# EAGLE schematic usbaspclone-1-1 (EAGLE 5.10)
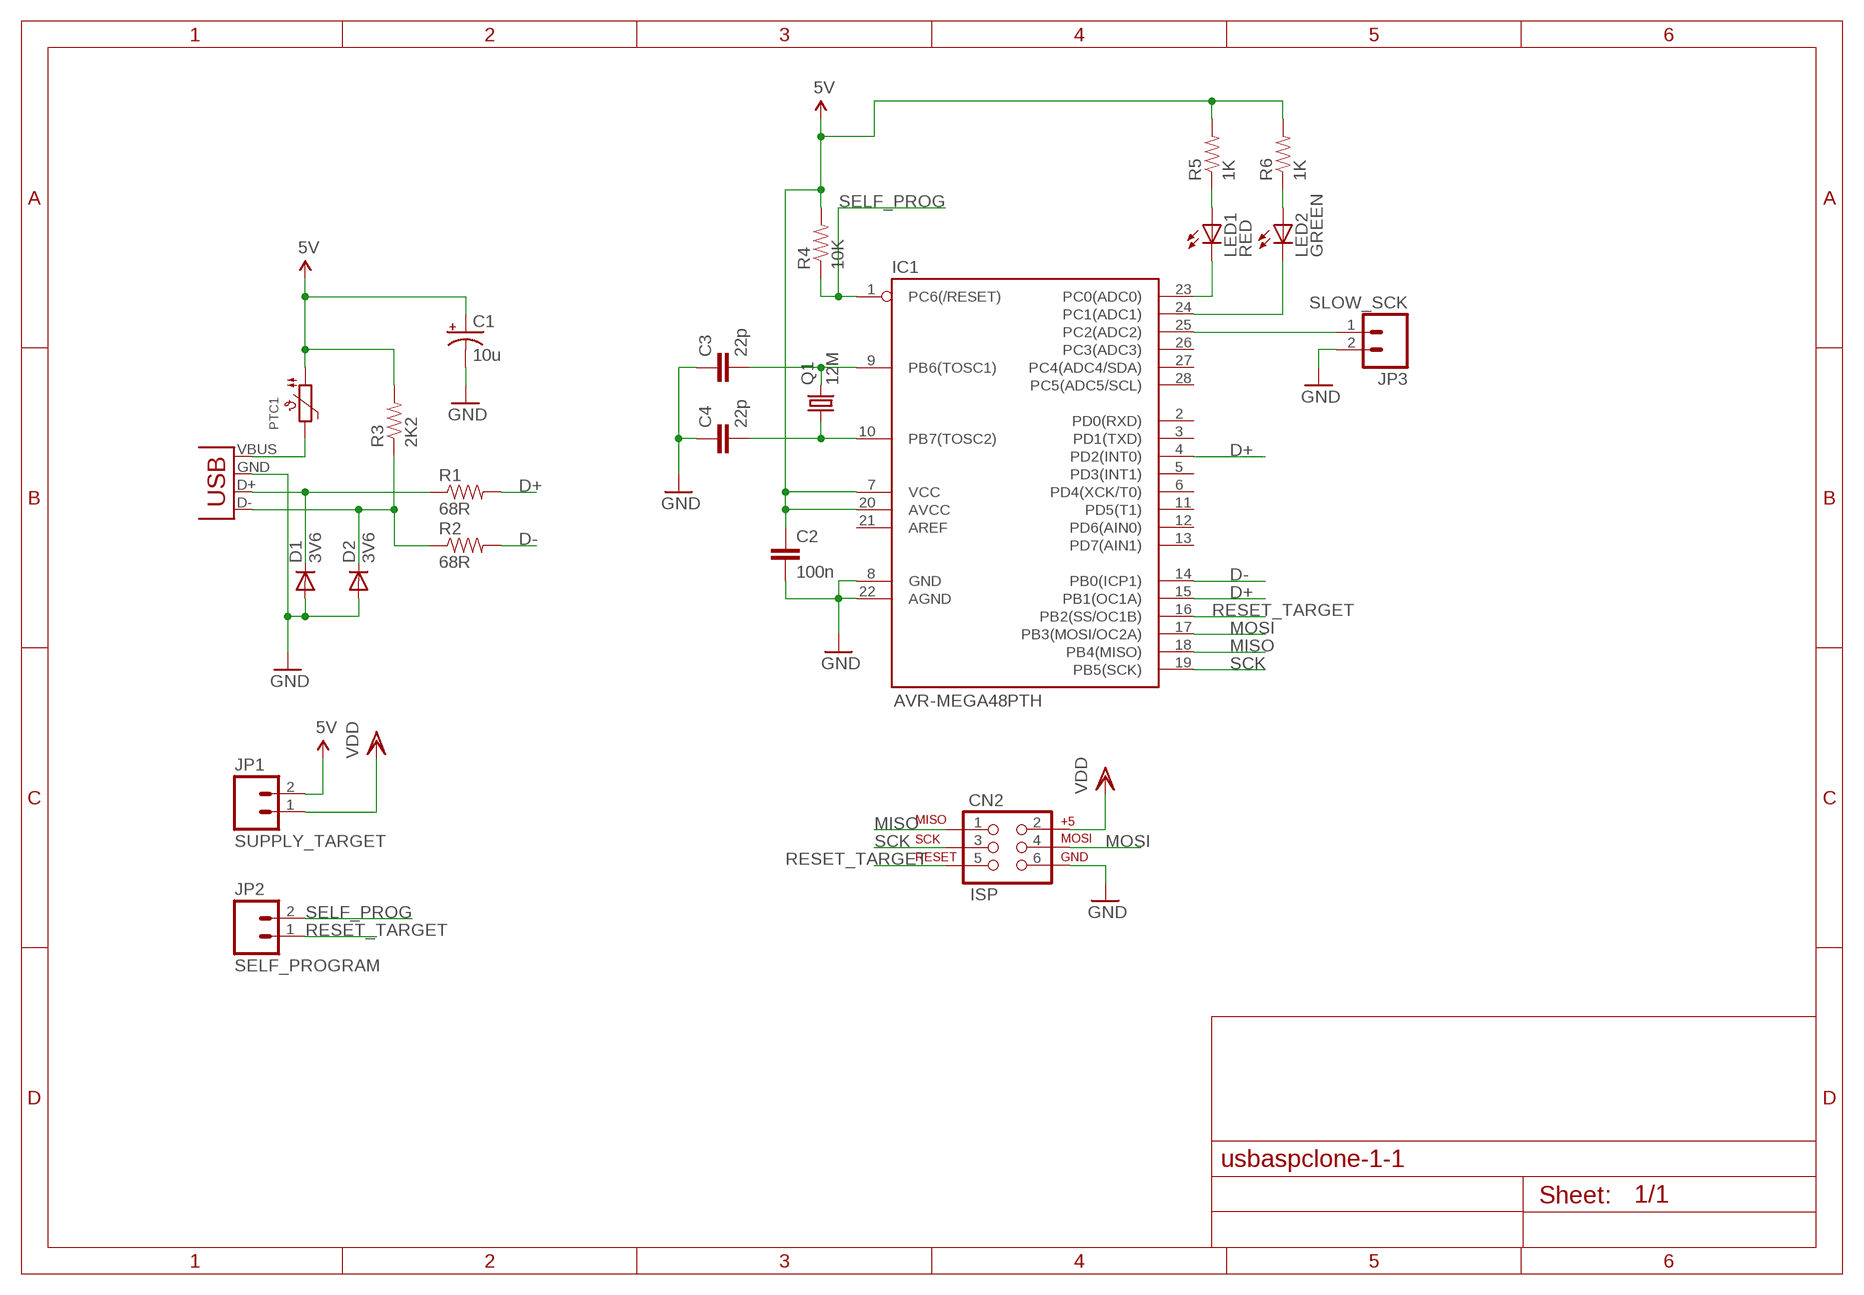
[diagram p0: schematic, sheet 1]

## Parts
C1  10u  CAP_POL1206  [EIA3216]
C2  100n  CAP0805  [0805]
C3  22p  CAP0805  [0805]
C4  22p  CAP0805  [0805]
CN1  USB-A-H  [USB-A-H]
CN2  ISP  AVR_SPI_PRG_6PTH  [2X3]
D1  3V6  DIODE  [SOD80C]
D2  3V6  DIODE  [SOD80C]
IC1  AVR-MEGA48PTH  [DIL28-3]
JP1  SUPPLY_TARGET  M02PTH  [1X02]
JP2  SELF_PROGRAM  M02PTH  [1X02]
JP3  SLOW_SCK  M02PTH  [1X02]
LED1  RED  LED3MM  [LED3MM]
LED2  GREEN  LED3MM  [LED3MM]
PTC1  PTC1812  [PTC1812]
Q1  12M  CRYSTALHC49US  [HC49US]
R1  68R  RESISTOR0805  [0805]
R2  68R  RESISTOR0805  [0805]
R3  2K2  RESISTOR0805  [0805]
R4  10K  RESISTOR0805  [0805]
R5  1K  RESISTOR0805  [0805]
R6  1K  RESISTOR0805  [0805]

## Nets
5V: C1.A(+) C2.1 IC1.7(VCC) IC1.20(AVCC) JP1.2 PTC1.P$1 R3.2 R4.2 R5.2 R6.2
AGND: C2.2 IC1.8(GND) IC1.22(AGND) ; supply symbol labelled GND
D+: IC1.4(PD2(INT0)) IC1.15(PB1(OC1A)) R1.2
D-: IC1.14(PB0(ICP1)) R2.2
GND: C1.C(-) C3.1 C4.1 CN1.GND(VBUS) CN2.6 D1.A D2.A JP3.2
MISO: CN2.1 IC1.18(PB4(MISO))
MOSI: CN2.4 IC1.17(PB3(MOSI/OC2A))
N$1: CN1.VBUS(GND) PTC1.P$2
N$2: CN1.D+(D-) D1.C R1.1
N$3: CN1.D-(D+) D2.C R2.1 R3.1
N$4: C3.2 IC1.9(PB6(TOSC1)) Q1.2
N$5: C4.2 IC1.10(PB7(TOSC2)) Q1.1
N$6: IC1.23(PC0(ADC0)) LED1.K(C)
N$7: LED1.A R5.1
N$8: IC1.24(PC1(ADC1)) LED2.K(C)
N$9: LED2.A R6.1
N$11: IC1.25(PC2(ADC2)) JP3.1
RESET_TARGET: CN2.5 IC1.16(PB2(SS/OC1B)) JP2.1
SCK: CN2.3 IC1.19(PB5(SCK))
SELF_PROG: IC1.1(PC6(/RESET)) JP2.2 R4.1
VDD: CN2.2 JP1.1
Unconnected: IC1.2(PD0(RXD)) IC1.3(PD1(TXD)) IC1.5(PD3(INT1)) IC1.6(PD4(XCK/T0)) IC1.11(PD5(T1)) IC1.12(PD6(AIN0)) IC1.13(PD7(AIN1)) IC1.21(AREF) IC1.26(PC3(ADC3)) IC1.27(PC4(ADC4/SDA)) IC1.28(PC5(ADC5/SCL))

## Library data of the parts
C1 = usbaspclone:CAP_POL: Capacitor Polarized These are standard SMD and PTH capacitors. Normally 10uF, 47uF, and 100uF in electrolytic and tantalum varieties. Always verify the external diameter of the through hole cap, it varies with capacity, voltage, and manufacturer. The EIA devices should be standard.
C2-C4 = usbaspclone:CAP: Capacitor Standard 0603 ceramic capacitor, and 0.1" leaded capacitor.
CN1 = usbaspclone:USB: USB Connectors USB-B-PTH is fully proven SKU : PRT-00139 USB-miniB is fully proven SKU : PRT-00587 USB-A-PCB is untested. USB-A-H is throughly reviewed, but untested. Spark Fun Electronics SKU : PRT-00437 USB-B-SMT is throughly reviewed, but untested. Needs silkscreen touching up. USB-A-S has not been used/tested USB-MB-H has not been used/tested
CN2 = usbaspclone:AVR_SPI_PRG_6: AVR ISP 6 Pin This is the reduced ISP connector for AVR programming. Common on Arduino. This footprint will take up less PCB space and can be used with a 10-pin to 6-pin adapter such as SKU: BOB-08508
D1 D2 = usbaspclone:DIODE: Diode These are standard reverse protection diodes and small signal diodes. SMA package can handle up to about 1A. SOD-323 can handle about 200mA. What the SOD-323 package when ordering, there are some mfgs out there that are 5-pin packages.
IC1 = usbaspclone:AVR-MEGA48: MICROCONTROLLER ATmega48/88/168
JP1-JP3 = usbaspclone:M02: Header 2 Standard 2-pin 0.1" header. Use with straight break away headers (SKU : PRT-00116), right angle break away headers (PRT-00553), swiss pins (PRT-00743), machine pins (PRT-00117), and female headers (PRT-00115). Molex polarized connector foot print use with SKU : PRT-08233 with associated crimp pins and housings.
LED1 LED2 = usbaspclone:LED: LEDs Standard schematic elements and footprints for 5mm, 3mm, 1206, and 0603 sized LEDs. 5mm - Spark Fun Electronics SKU : COM-00529 (and others)
PTC1 = usbaspclone:PTC: PTC (Resettable Fuse) 1206 Package 250mA PTC (16V Max, Time-to-Trip: 0.08s) - Digikey: F2110CT-ND 1210 Package 100mA PTC (30V Max, Time-to-Trip: 0.6s) - Digikey: MF-USMF010-2CT-ND 1812 Package 750mA PTC (24V Max, Time-to-Trip: 0.2s) - Digikey: MF-MSMF075/24-2CT-ND
Q1 = usbaspclone:CRYSTAL: Crystals Various standard crystals. Proven footprints. Spark Fun Electronics SKU : COM-00534
R1-R6 = usbaspclone:RESISTOR: Resistor Basic schematic elements and footprints for 0402, 0603, 0805, 1206, PTH 1/10th watt (small), 0102, 0204, and etc. resistors.